# Altium schematic sheet PWM_CON_Outputs.SchDoc: PWM Motor Controller -  Ouputs
size A4; DocumentNumber: 3; Revision: 2; SheetNumber: 3; SheetTotal: 5; DrawnBy: T. Burns; Organization: N/A; ProjectName: PWM Motor Controller
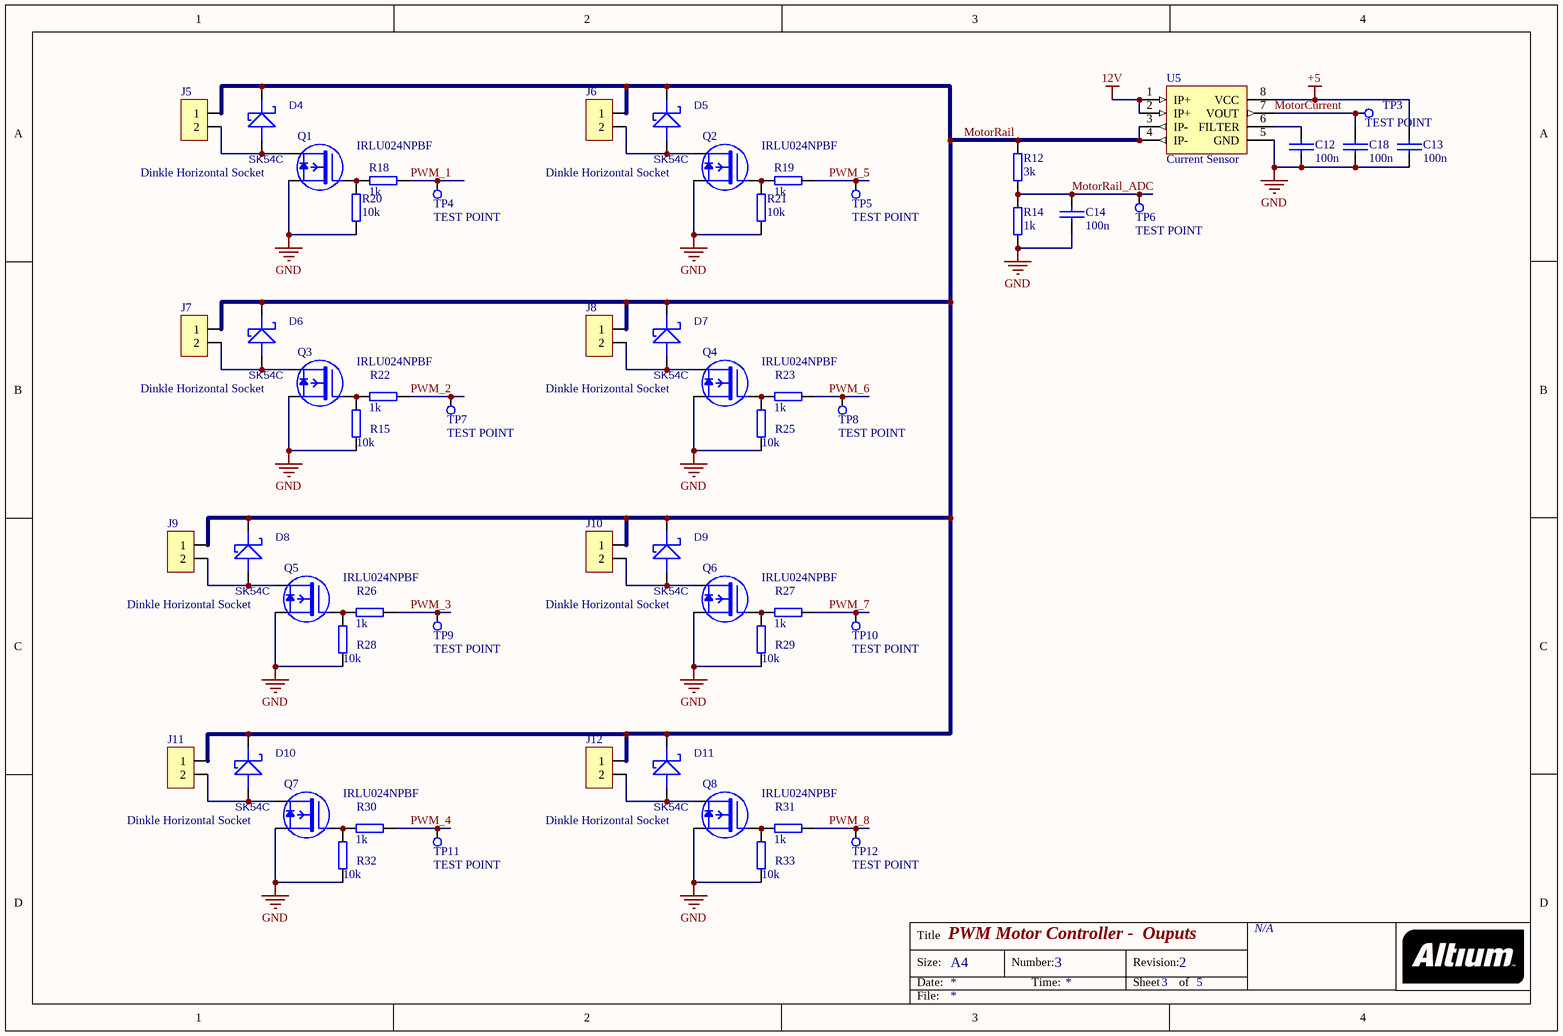
[diagram p0: PWM_CON_Outputs.SchDoc]

## Parts
C12  100n  [0603]
C13  100n  [0603]
C14  100n  [0603]
C18  100n  [0603]
D4  SK54C  [SMC]
D5  SK54C  [SMC]
D6  SK54C  [SMC]
D7  SK54C  [SMC]
D8  SK54C  [SMC]
D9  SK54C  [SMC]
D10  SK54C  [SMC]
D11  SK54C  [SMC]
J5  Dinkle Horizontal Socket  [WEID2R]
J6  Dinkle Horizontal Socket  [WEID2R]
J7  Dinkle Horizontal Socket  [WEID2R]
J8  Dinkle Horizontal Socket  [WEID2R]
J9  Dinkle Horizontal Socket  [WEID2R]
J10  Dinkle Horizontal Socket  [WEID2R]
J11  Dinkle Horizontal Socket  [WEID2R]
J12  Dinkle Horizontal Socket  [WEID2R]
Q1  IRLU024NPBF  [TO-251]
Q2  IRLU024NPBF  [TO-251]
Q3  IRLU024NPBF  [TO-251]
Q4  IRLU024NPBF  [TO-251]
Q5  IRLU024NPBF  [TO-251]
Q6  IRLU024NPBF  [TO-251]
Q7  IRLU024NPBF  [TO-251]
Q8  IRLU024NPBF  [TO-251]
R12  3k  [0603]
R14  1k  [0603]
R15  10k  [0603]
R18  1k  [0603]
R19  1k  [0603]
R20  10k  [0603]
R21  10k  [0603]
R22  1k  [0603]
R23  1k  [0603]
R25  10k  [0603]
R26  1k  [0603]
R27  1k  [0603]
R28  10k  [0603]
R29  10k  [0603]
R30  1k  [0603]
R31  1k  [0603]
R32  10k  [0603]
R33  10k  [0603]
TP3  TEST POINT  [TEST POINT]
TP4  TEST POINT  [TEST POINT]
TP5  TEST POINT  [TEST POINT]
TP6  TEST POINT  [TEST POINT]
TP7  TEST POINT  [TEST POINT]
TP8  TEST POINT  [TEST POINT]
TP9  TEST POINT  [TEST POINT]
TP10  TEST POINT  [TEST POINT]
TP11  TEST POINT  [TEST POINT]
TP12  TEST POINT  [TEST POINT]
U5  Current Sensor  [so-8]

## Nets
12V: U5.1(IP+) U5.2(IP+)
+5: C13.2 U5.8(VCC)
GND: C12.1 C13.1 C14.1 C18.1 Q1.S Q2.S Q3.S Q4.S Q5.S Q6.S Q7.S Q8.S R14.2 R15.1 R20.1 R21.1 R25.1 R28.1 R29.1 R32.1 R33.1 U5.5(GND)
MotorCurrent: C18.2 TP3.1 U5.7(VOUT)
MotorRail: D4.K D5.K D6.K D7.K D8.K D9.K D10.K D11.K J5.1 J6.1 J7.1 J8.1 J9.1 J10.1 J11.1 J12.1 R12.2 U5.3(IP-) U5.4(IP-)
MotorRail_ADC: C14.2 R12.1 R14.1 TP6.1
PWM_1: R18.1 TP4.1
PWM_2: R22.1 TP7.1
PWM_3: R26.1 TP9.1
PWM_4: R30.1 TP11.1
PWM_5: R19.1 TP5.1
PWM_6: R23.1 TP8.1
PWM_7: R27.1 TP10.1
PWM_8: R31.1 TP12.1
NetC12_2: C12.2 U5.6(FILTER)
NetD4_A: D4.A J5.2 Q1.D
NetD5_A: D5.A J6.2 Q2.D
NetD6_A: D6.A J7.2 Q3.D
NetD7_A: D7.A J8.2 Q4.D
NetD8_A: D8.A J9.2 Q5.D
NetD9_A: D9.A J10.2 Q6.D
NetD10_A: D10.A J11.2 Q7.D
NetD11_A: D11.A J12.2 Q8.D
NetQ1_G: Q1.G R18.2 R20.2
NetQ2_G: Q2.G R19.2 R21.2
NetQ3_G: Q3.G R15.2 R22.2
NetQ4_G: Q4.G R23.2 R25.2
NetQ5_G: Q5.G R26.2 R28.2
NetQ6_G: Q6.G R27.2 R29.2
NetQ7_G: Q7.G R30.2 R32.2
NetQ8_G: Q8.G R31.2 R33.2

## Notes on the sheet
- Title
- Size:
- Date:
- A4
- Number:
- Time:
- Revision:
- Sheet
- of
- File:

## Library data of the parts
C12-C14 C18 = CAP: PartNo: R8835; Supplier: Altronics
D4-D11 = DIODE SCHOTTKY: PartNo: 1299291; Supplier: Element14
J5-J12 = CON2: PartNo: P2552; Supplier: Altronics
Q1-Q8 = MOSFET-N1DSML: N Channel MOSFET; PartNo: 8651329; Manuf: INTERNATIONAL RECTIFIER; Id: 17A; Vds: 55V; PowerDisp: 46W; Supplier: Element14
R12 = RES8: 1% Resistor; PartNo: R1629; Supplier: Altronics
R14 R18 R19 R22 R23 R26 R27 R30 R31 = RES8: 1% Resistor; PartNo: R1596; Supplier: Altronics
R15 R20 R21 R25 R28 R29 R32 R33 = RES8: 1% Resistor; PartNo: R1668; Supplier: Altronics
TP3-TP12 = TEST POINT: Probe compatible test point
U5 = ACS714: +/- XA Current Sensor; Supplier: Digi-key